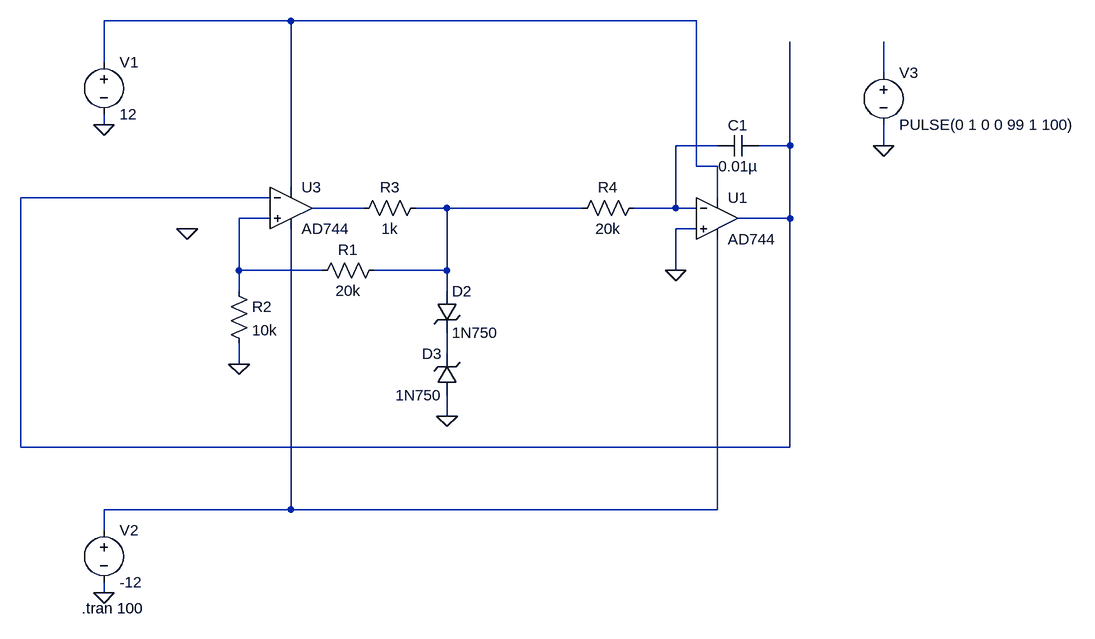
[diagram p0: schematic Draft1.asc]
Draft1.asc, the LTspice schematic file:
Version 4
SHEET 1 1160 712
WIRE -64 -208 -352 -208
WIRE 560 -208 -64 -208
WIRE -352 -144 -352 -208
WIRE 848 -128 848 -176
WIRE -352 -48 -352 -64
WIRE 592 -16 528 -16
WIRE 704 -16 704 -176
WIRE 704 -16 656 -16
WIRE 848 -16 848 -48
WIRE 560 16 560 -208
WIRE 592 16 560 16
WIRE -64 48 -64 -208
WIRE -96 64 -480 64
WIRE 592 64 592 16
WIRE 48 80 -32 80
WIRE 176 80 128 80
WIRE 384 80 176 80
WIRE 528 80 528 -16
WIRE 528 80 464 80
WIRE 560 80 528 80
WIRE -96 96 -144 96
WIRE 704 96 704 -16
WIRE 704 96 624 96
WIRE 560 112 528 112
WIRE -144 176 -144 96
WIRE -16 176 -144 176
WIRE 176 176 176 80
WIRE 176 176 64 176
WIRE 528 176 528 112
WIRE -144 208 -144 176
WIRE 176 208 176 176
WIRE 176 304 176 272
WIRE -144 320 -144 288
WIRE 176 400 176 368
WIRE -480 448 -480 64
WIRE 704 448 704 96
WIRE 704 448 -480 448
WIRE -64 544 -64 112
WIRE -64 544 -352 544
WIRE 592 544 592 128
WIRE 592 544 -64 544
WIRE -352 576 -352 544
WIRE -352 672 -352 656
FLAG -224 112 0
FLAG 176 400 0
FLAG 528 176 0
FLAG -352 -48 0
FLAG -352 672 0
FLAG -144 320 0
FLAG 848 -16 0
SYMBOL zener 160 208 R0
SYMATTR InstName D2
SYMATTR Value 1N750
SYMBOL zener 192 368 R180
WINDOW 0 24 64 Left 2
WINDOW 3 24 0 Left 2
SYMATTR InstName D3
SYMATTR Value 1N750
SYMBOL res 80 160 R90
WINDOW 0 0 56 VBottom 2
WINDOW 3 32 56 VTop 2
SYMATTR InstName R1
SYMATTR Value 20k
SYMBOL res -160 192 R0
SYMATTR InstName R2
SYMATTR Value 10k
SYMBOL res 144 64 R90
WINDOW 0 0 56 VBottom 2
WINDOW 3 32 56 VTop 2
SYMATTR InstName R3
SYMATTR Value 1k
SYMBOL res 480 64 R90
WINDOW 0 0 56 VBottom 2
WINDOW 3 32 56 VTop 2
SYMATTR InstName R4
SYMATTR Value 20k
SYMBOL cap 656 -32 R90
WINDOW 0 0 32 VBottom 2
WINDOW 3 32 32 VTop 2
SYMATTR InstName C1
SYMATTR Value 0.01µ
SYMBOL voltage -352 -160 R0
WINDOW 123 0 0 Left 0
WINDOW 39 0 0 Left 0
SYMATTR InstName V1
SYMATTR Value 12
SYMBOL voltage -352 560 R0
WINDOW 123 0 0 Left 0
WINDOW 39 0 0 Left 0
SYMATTR InstName V2
SYMATTR Value -12
SYMBOL OpAmps\\AD744 -64 16 R0
SYMATTR InstName U3
SYMBOL OpAmps\\AD744 592 32 R0
SYMATTR InstName U1
SYMBOL voltage 848 -144 R0
WINDOW 123 0 0 Left 0
WINDOW 39 0 0 Left 0
SYMATTR InstName V3
SYMATTR Value PULSE(0 1 0 0 99 1 100)
TEXT -386 696 Left 2 !.tran 100

The netlist it stands for:
* Draft1.asc
D2 N006 N008 1N750
D3 0 N008 1N750
R1 N006 N007 20k
R2 N007 0 10k
R3 N006 N005 1k
R4 N003 N006 20k
C1 N004 N003 0.01µ
V1 N001 0 12
V2 N009 0 -12
XU3 N007 N004 N001 N009 N005 AD744  ; pins In+ In- V+ V- OUT
XU1 0 N003 N001 N009 N004 AD744  ; pins In+ In- V+ V- OUT
V3 N002 0 PULSE(0 1 0 0 99 1 100)
.model D D
.lib standard.dio
.tran 100
.backanno
.end